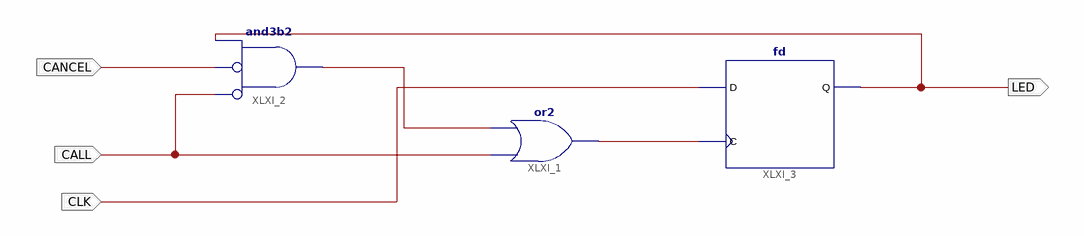
[diagram p0: schematic sheet 1]
// Xilinx ISE schematic CallSystem.sch (spartan3e) as structural Verilog: 3 symbols, 4 ports
module CallSystem (
  input  CLK,
  input  CALL,
  input  CANCEL,
  output LED
);

  wire XLXN_1, XLXN_2;

  or XLXI_1 (XLXN_2, CALL, XLXN_1);
  and XLXI_2 (XLXN_1, ~CALL, ~CANCEL, LED);  // and3b2
  fd XLXI_3 (.C(XLXN_2), .D(CLK), .Q(LED));
endmodule
